# Altium schematic sheet RGBM-02.SchDoc
size Tabloid; SheetNumber: 2; SheetTotal: 7
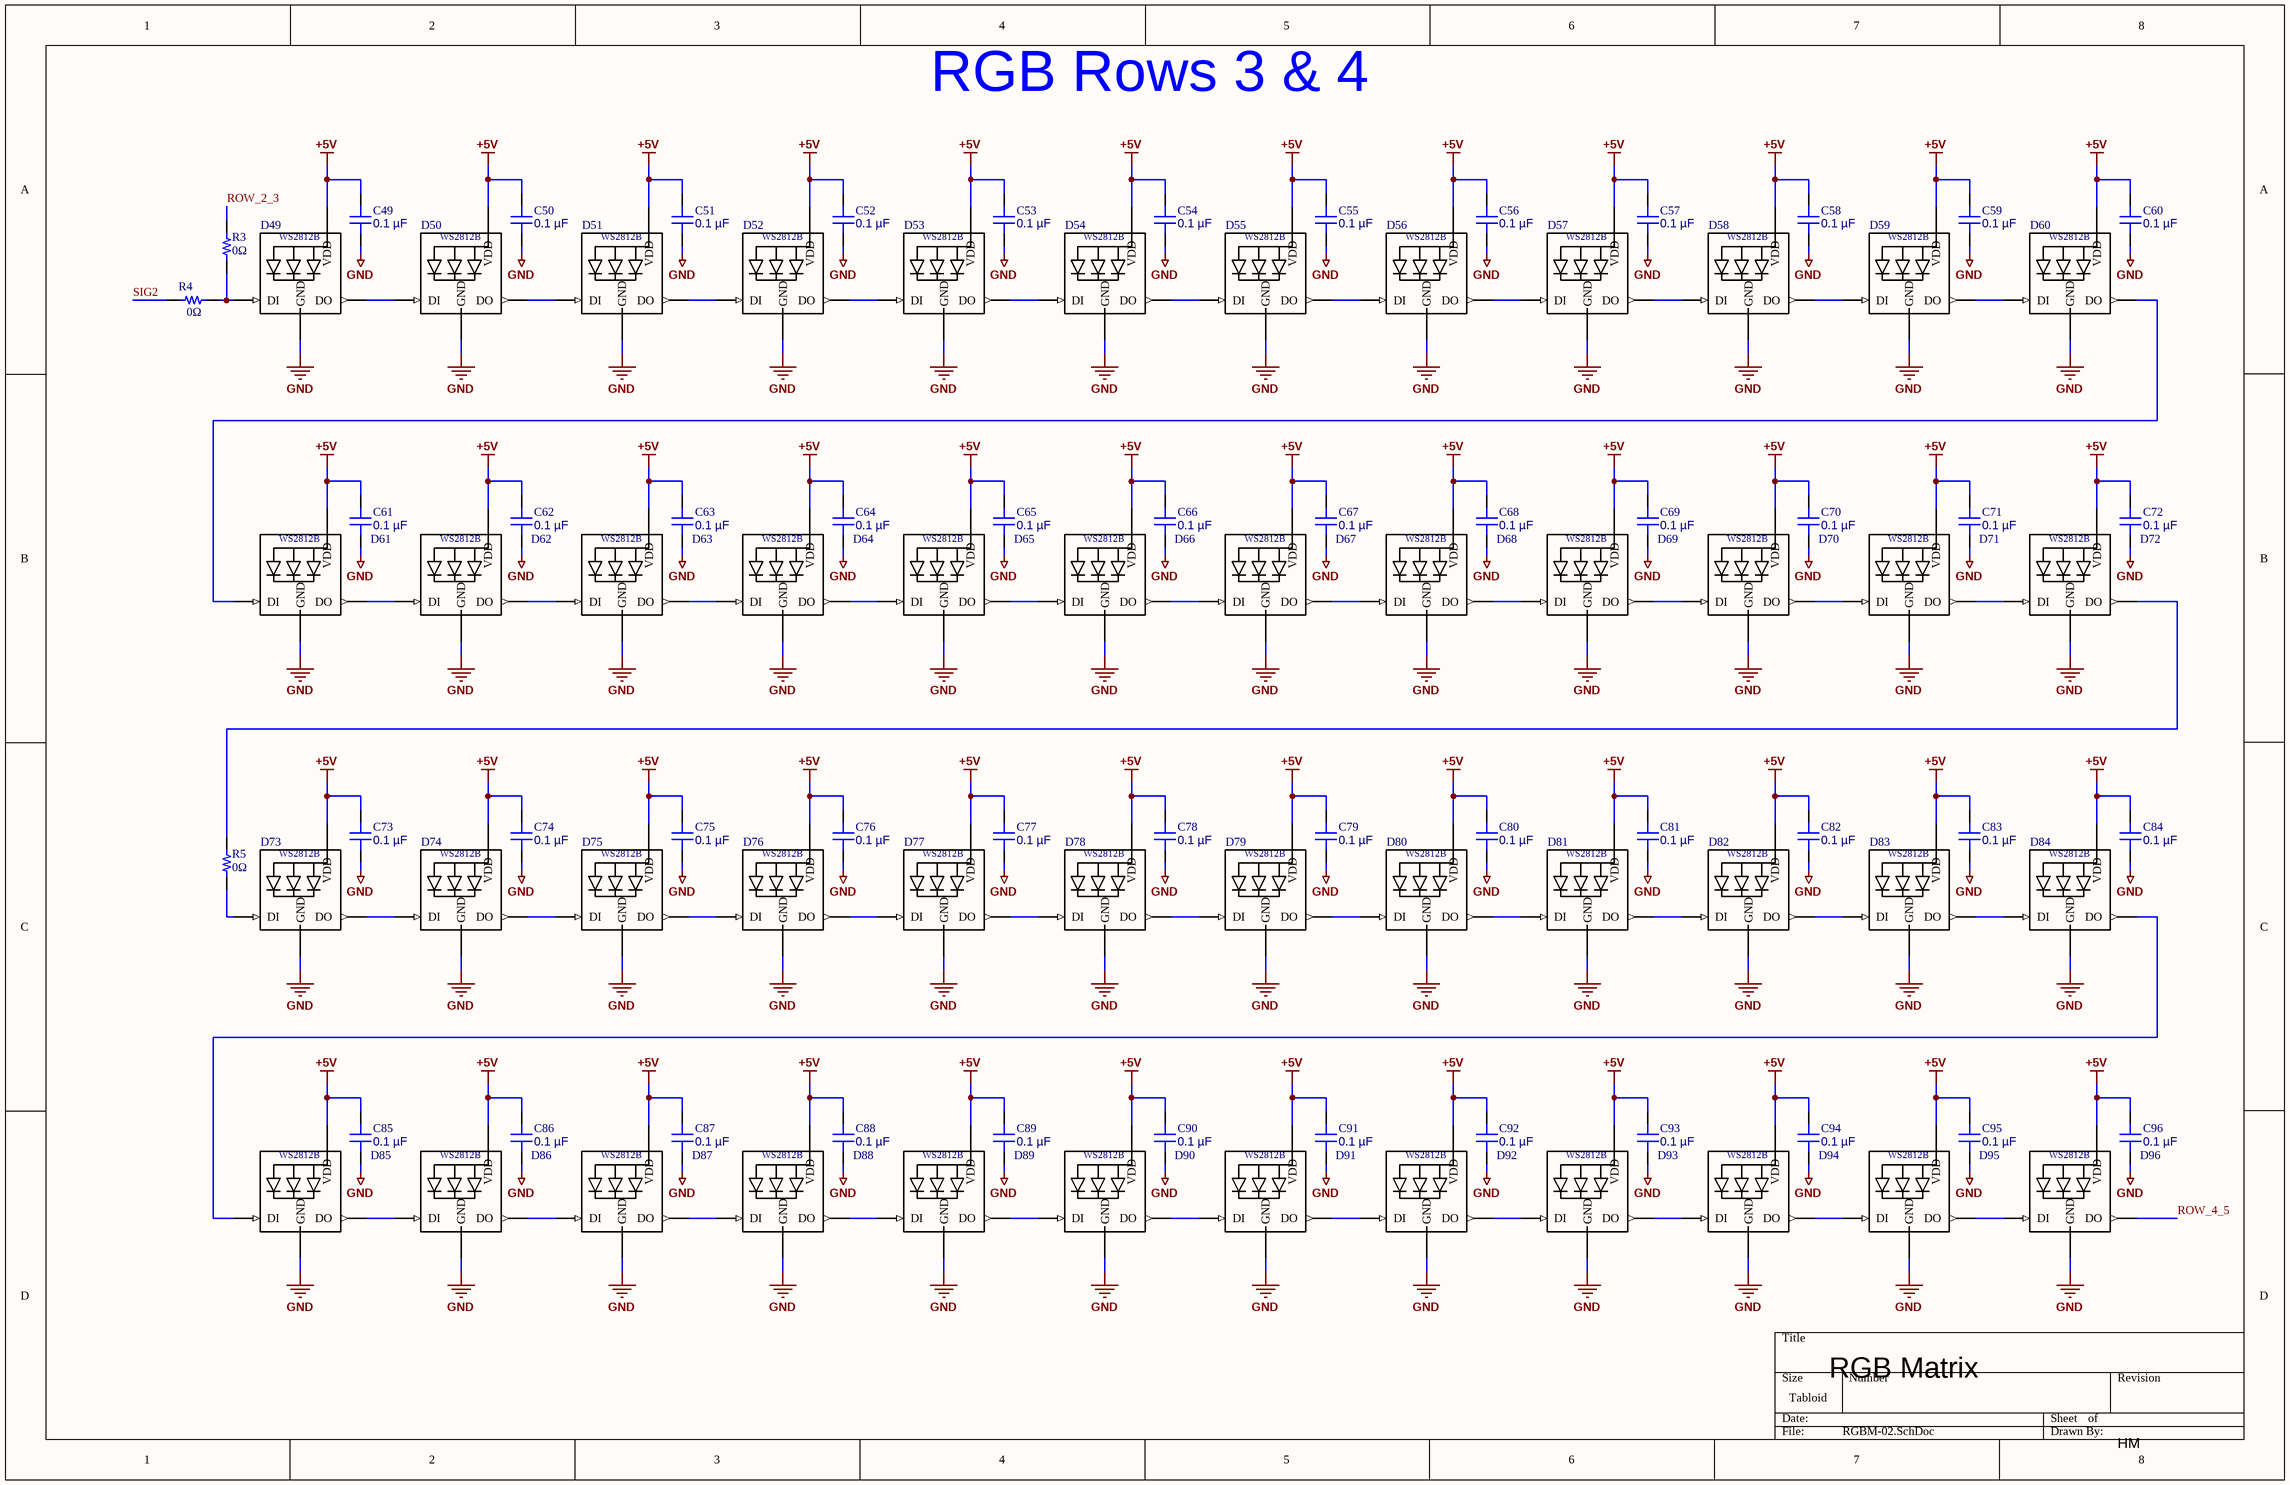
[diagram p0: RGBM-02.SchDoc]

## Parts
C49  0.1 µF  [CAP 0603_1608]
C50  0.1 µF  [CAP 0603_1608]
C51  0.1 µF  [CAP 0603_1608]
C52  0.1 µF  [CAP 0603_1608]
C53  0.1 µF  [CAP 0603_1608]
C54  0.1 µF  [CAP 0603_1608]
C55  0.1 µF  [CAP 0603_1608]
C56  0.1 µF  [CAP 0603_1608]
C57  0.1 µF  [CAP 0603_1608]
C58  0.1 µF  [CAP 0603_1608]
C59  0.1 µF  [CAP 0603_1608]
C60  0.1 µF  [CAP 0603_1608]
C61  0.1 µF  [CAP 0603_1608]
C62  0.1 µF  [CAP 0603_1608]
C63  0.1 µF  [CAP 0603_1608]
C64  0.1 µF  [CAP 0603_1608]
C65  0.1 µF  [CAP 0603_1608]
C66  0.1 µF  [CAP 0603_1608]
C67  0.1 µF  [CAP 0603_1608]
C68  0.1 µF  [CAP 0603_1608]
C69  0.1 µF  [CAP 0603_1608]
C70  0.1 µF  [CAP 0603_1608]
C71  0.1 µF  [CAP 0603_1608]
C72  0.1 µF  [CAP 0603_1608]
C73  0.1 µF  [CAP 0603_1608]
C74  0.1 µF  [CAP 0603_1608]
C75  0.1 µF  [CAP 0603_1608]
C76  0.1 µF  [CAP 0603_1608]
C77  0.1 µF  [CAP 0603_1608]
C78  0.1 µF  [CAP 0603_1608]
C79  0.1 µF  [CAP 0603_1608]
C80  0.1 µF  [CAP 0603_1608]
C81  0.1 µF  [CAP 0603_1608]
C82  0.1 µF  [CAP 0603_1608]
C83  0.1 µF  [CAP 0603_1608]
C84  0.1 µF  [CAP 0603_1608]
C85  0.1 µF  [CAP 0603_1608]
C86  0.1 µF  [CAP 0603_1608]
C87  0.1 µF  [CAP 0603_1608]
C88  0.1 µF  [CAP 0603_1608]
C89  0.1 µF  [CAP 0603_1608]
C90  0.1 µF  [CAP 0603_1608]
C91  0.1 µF  [CAP 0603_1608]
C92  0.1 µF  [CAP 0603_1608]
C93  0.1 µF  [CAP 0603_1608]
C94  0.1 µF  [CAP 0603_1608]
C95  0.1 µF  [CAP 0603_1608]
C96  0.1 µF  [CAP 0603_1608]
D49  WS2812B  [*WS2812B_WS2812B(Primary)]  (value not drawn)
D50  WS2812B  [*WS2812B_WS2812B(Primary)]  (value not drawn)
D51  WS2812B  [*WS2812B_WS2812B(Primary)]  (value not drawn)
D52  WS2812B  [*WS2812B_WS2812B(Primary)]  (value not drawn)
D53  WS2812B  [*WS2812B_WS2812B(Primary)]  (value not drawn)
D54  WS2812B  [*WS2812B_WS2812B(Primary)]  (value not drawn)
D55  WS2812B  [*WS2812B_WS2812B(Primary)]  (value not drawn)
D56  WS2812B  [*WS2812B_WS2812B(Primary)]  (value not drawn)
D57  WS2812B  [*WS2812B_WS2812B(Primary)]  (value not drawn)
D58  WS2812B  [*WS2812B_WS2812B(Primary)]  (value not drawn)
D59  WS2812B  [*WS2812B_WS2812B(Primary)]  (value not drawn)
D60  WS2812B  [*WS2812B_WS2812B(Primary)]  (value not drawn)
D61  WS2812B  [*WS2812B_WS2812B(Primary)]  (value not drawn)
D62  WS2812B  [*WS2812B_WS2812B(Primary)]  (value not drawn)
D63  WS2812B  [*WS2812B_WS2812B(Primary)]  (value not drawn)
D64  WS2812B  [*WS2812B_WS2812B(Primary)]  (value not drawn)
D65  WS2812B  [*WS2812B_WS2812B(Primary)]  (value not drawn)
D66  WS2812B  [*WS2812B_WS2812B(Primary)]  (value not drawn)
D67  WS2812B  [*WS2812B_WS2812B(Primary)]  (value not drawn)
D68  WS2812B  [*WS2812B_WS2812B(Primary)]  (value not drawn)
D69  WS2812B  [*WS2812B_WS2812B(Primary)]  (value not drawn)
D70  WS2812B  [*WS2812B_WS2812B(Primary)]  (value not drawn)
D71  WS2812B  [*WS2812B_WS2812B(Primary)]  (value not drawn)
D72  WS2812B  [*WS2812B_WS2812B(Primary)]  (value not drawn)
D73  WS2812B  [*WS2812B_WS2812B(Primary)]  (value not drawn)
D74  WS2812B  [*WS2812B_WS2812B(Primary)]  (value not drawn)
D75  WS2812B  [*WS2812B_WS2812B(Primary)]  (value not drawn)
D76  WS2812B  [*WS2812B_WS2812B(Primary)]  (value not drawn)
D77  WS2812B  [*WS2812B_WS2812B(Primary)]  (value not drawn)
D78  WS2812B  [*WS2812B_WS2812B(Primary)]  (value not drawn)
D79  WS2812B  [*WS2812B_WS2812B(Primary)]  (value not drawn)
D80  WS2812B  [*WS2812B_WS2812B(Primary)]  (value not drawn)
D81  WS2812B  [*WS2812B_WS2812B(Primary)]  (value not drawn)
D82  WS2812B  [*WS2812B_WS2812B(Primary)]  (value not drawn)
D83  WS2812B  [*WS2812B_WS2812B(Primary)]  (value not drawn)
D84  WS2812B  [*WS2812B_WS2812B(Primary)]  (value not drawn)
D85  WS2812B  [*WS2812B_WS2812B(Primary)]  (value not drawn)
D86  WS2812B  [*WS2812B_WS2812B(Primary)]  (value not drawn)
D87  WS2812B  [*WS2812B_WS2812B(Primary)]  (value not drawn)
D88  WS2812B  [*WS2812B_WS2812B(Primary)]  (value not drawn)
D89  WS2812B  [*WS2812B_WS2812B(Primary)]  (value not drawn)
D90  WS2812B  [*WS2812B_WS2812B(Primary)]  (value not drawn)
D91  WS2812B  [*WS2812B_WS2812B(Primary)]  (value not drawn)
D92  WS2812B  [*WS2812B_WS2812B(Primary)]  (value not drawn)
D93  WS2812B  [*WS2812B_WS2812B(Primary)]  (value not drawn)
D94  WS2812B  [*WS2812B_WS2812B(Primary)]  (value not drawn)
D95  WS2812B  [*WS2812B_WS2812B(Primary)]  (value not drawn)
D96  WS2812B  [*WS2812B_WS2812B(Primary)]  (value not drawn)
R3  0Ω  [RES 0603_1608]
R4  0Ω  [RES 0603_1608]
R5  0Ω  [RES 0603_1608]

## Nets
+5V: C49.2 C50.2 C51.2 C52.2 C53.2 C54.2 C55.2 C56.2 C57.2 C58.2 C59.2 C60.2 C61.2 C62.2 C63.2 C64.2 C65.2 C66.2 C67.2 C68.2 C69.2 C70.2 C71.2 C72.2 C73.2 C74.2 C75.2 C76.2 C77.2 C78.2 C79.2 C80.2 C81.2 C82.2 C83.2 C84.2 C85.2 C86.2 C87.2 C88.2 C89.2 C90.2 C91.2 C92.2 C93.2 C94.2 C95.2 C96.2 D49.1-VDD(VDD) D50.1-VDD(VDD) D51.1-VDD(VDD) D52.1-VDD(VDD) D53.1-VDD(VDD) D54.1-VDD(VDD) D55.1-VDD(VDD) D56.1-VDD(VDD) D57.1-VDD(VDD) D58.1-VDD(VDD) D59.1-VDD(VDD) D60.1-VDD(VDD) D61.1-VDD(VDD) D62.1-VDD(VDD) D63.1-VDD(VDD) D64.1-VDD(VDD) D65.1-VDD(VDD) D66.1-VDD(VDD) D67.1-VDD(VDD) D68.1-VDD(VDD) D69.1-VDD(VDD) D70.1-VDD(VDD) D71.1-VDD(VDD) D72.1-VDD(VDD) D73.1-VDD(VDD) D74.1-VDD(VDD) D75.1-VDD(VDD) D76.1-VDD(VDD) D77.1-VDD(VDD) D78.1-VDD(VDD) D79.1-VDD(VDD) D80.1-VDD(VDD) D81.1-VDD(VDD) D82.1-VDD(VDD) D83.1-VDD(VDD) D84.1-VDD(VDD) D85.1-VDD(VDD) D86.1-VDD(VDD) D87.1-VDD(VDD) D88.1-VDD(VDD) D89.1-VDD(VDD) D90.1-VDD(VDD) D91.1-VDD(VDD) D92.1-VDD(VDD) D93.1-VDD(VDD) D94.1-VDD(VDD) D95.1-VDD(VDD) D96.1-VDD(VDD)
GND: C49.1 C50.1 C51.1 C52.1 C53.1 C54.1 C55.1 C56.1 C57.1 C58.1 C59.1 C60.1 C61.1 C62.1 C63.1 C64.1 C65.1 C66.1 C67.1 C68.1 C69.1 C70.1 C71.1 C72.1 C73.1 C74.1 C75.1 C76.1 C77.1 C78.1 C79.1 C80.1 C81.1 C82.1 C83.1 C84.1 C85.1 C86.1 C87.1 C88.1 C89.1 C90.1 C91.1 C92.1 C93.1 C94.1 C95.1 C96.1 D49.3-GND(GND) D50.3-GND(GND) D51.3-GND(GND) D52.3-GND(GND) D53.3-GND(GND) D54.3-GND(GND) D55.3-GND(GND) D56.3-GND(GND) D57.3-GND(GND) D58.3-GND(GND) D59.3-GND(GND) D60.3-GND(GND) D61.3-GND(GND) D62.3-GND(GND) D63.3-GND(GND) D64.3-GND(GND) D65.3-GND(GND) D66.3-GND(GND) D67.3-GND(GND) D68.3-GND(GND) D69.3-GND(GND) D70.3-GND(GND) D71.3-GND(GND) D72.3-GND(GND) D73.3-GND(GND) D74.3-GND(GND) D75.3-GND(GND) D76.3-GND(GND) D77.3-GND(GND) D78.3-GND(GND) D79.3-GND(GND) D80.3-GND(GND) D81.3-GND(GND) D82.3-GND(GND) D83.3-GND(GND) D84.3-GND(GND) D85.3-GND(GND) D86.3-GND(GND) D87.3-GND(GND) D88.3-GND(GND) D89.3-GND(GND) D90.3-GND(GND) D91.3-GND(GND) D92.3-GND(GND) D93.3-GND(GND) D94.3-GND(GND) D95.3-GND(GND) D96.3-GND(GND)
ROW_2_3: R3.2
ROW_4_5: D96.2-DOUT(DO)
SIG2: R4.1
NetD49_2-DOUT: D49.2-DOUT(DO) D50.4-DIN(DI)
NetD49_4-DIN: D49.4-DIN(DI) R3.1 R4.2
NetD50_2-DOUT: D50.2-DOUT(DO) D51.4-DIN(DI)
NetD51_2-DOUT: D51.2-DOUT(DO) D52.4-DIN(DI)
NetD52_2-DOUT: D52.2-DOUT(DO) D53.4-DIN(DI)
NetD53_2-DOUT: D53.2-DOUT(DO) D54.4-DIN(DI)
NetD54_2-DOUT: D54.2-DOUT(DO) D55.4-DIN(DI)
NetD55_2-DOUT: D55.2-DOUT(DO) D56.4-DIN(DI)
NetD56_2-DOUT: D56.2-DOUT(DO) D57.4-DIN(DI)
NetD57_2-DOUT: D57.2-DOUT(DO) D58.4-DIN(DI)
NetD58_2-DOUT: D58.2-DOUT(DO) D59.4-DIN(DI)
NetD59_2-DOUT: D59.2-DOUT(DO) D60.4-DIN(DI)
NetD60_2-DOUT: D60.2-DOUT(DO) D61.4-DIN(DI)
NetD61_2-DOUT: D61.2-DOUT(DO) D62.4-DIN(DI)
NetD62_2-DOUT: D62.2-DOUT(DO) D63.4-DIN(DI)
NetD63_2-DOUT: D63.2-DOUT(DO) D64.4-DIN(DI)
NetD64_2-DOUT: D64.2-DOUT(DO) D65.4-DIN(DI)
NetD65_2-DOUT: D65.2-DOUT(DO) D66.4-DIN(DI)
NetD66_2-DOUT: D66.2-DOUT(DO) D67.4-DIN(DI)
NetD67_2-DOUT: D67.2-DOUT(DO) D68.4-DIN(DI)
NetD68_2-DOUT: D68.2-DOUT(DO) D69.4-DIN(DI)
NetD69_2-DOUT: D69.2-DOUT(DO) D70.4-DIN(DI)
NetD70_2-DOUT: D70.2-DOUT(DO) D71.4-DIN(DI)
NetD71_2-DOUT: D71.2-DOUT(DO) D72.4-DIN(DI)
NetD72_2-DOUT: D72.2-DOUT(DO) R5.2
NetD73_2-DOUT: D73.2-DOUT(DO) D74.4-DIN(DI)
NetD73_4-DIN: D73.4-DIN(DI) R5.1
NetD74_2-DOUT: D74.2-DOUT(DO) D75.4-DIN(DI)
NetD75_2-DOUT: D75.2-DOUT(DO) D76.4-DIN(DI)
NetD76_2-DOUT: D76.2-DOUT(DO) D77.4-DIN(DI)
NetD77_2-DOUT: D77.2-DOUT(DO) D78.4-DIN(DI)
NetD78_2-DOUT: D78.2-DOUT(DO) D79.4-DIN(DI)
NetD79_2-DOUT: D79.2-DOUT(DO) D80.4-DIN(DI)
NetD80_2-DOUT: D80.2-DOUT(DO) D81.4-DIN(DI)
NetD81_2-DOUT: D81.2-DOUT(DO) D82.4-DIN(DI)
NetD82_2-DOUT: D82.2-DOUT(DO) D83.4-DIN(DI)
NetD83_2-DOUT: D83.2-DOUT(DO) D84.4-DIN(DI)
NetD84_2-DOUT: D84.2-DOUT(DO) D85.4-DIN(DI)
NetD85_2-DOUT: D85.2-DOUT(DO) D86.4-DIN(DI)
NetD86_2-DOUT: D86.2-DOUT(DO) D87.4-DIN(DI)
NetD87_2-DOUT: D87.2-DOUT(DO) D88.4-DIN(DI)
NetD88_2-DOUT: D88.2-DOUT(DO) D89.4-DIN(DI)
NetD89_2-DOUT: D89.2-DOUT(DO) D90.4-DIN(DI)
NetD90_2-DOUT: D90.2-DOUT(DO) D91.4-DIN(DI)
NetD91_2-DOUT: D91.2-DOUT(DO) D92.4-DIN(DI)
NetD92_2-DOUT: D92.2-DOUT(DO) D93.4-DIN(DI)
NetD93_2-DOUT: D93.2-DOUT(DO) D94.4-DIN(DI)
NetD94_2-DOUT: D94.2-DOUT(DO) D95.4-DIN(DI)
NetD95_2-DOUT: D95.2-DOUT(DO) D96.4-DIN(DI)

## Notes on the sheet
- RGB Rows 3 & 4
- RGB Matrix
- HM

## Library data of the parts
C49-C96 = C0603C104K5RAC7411: CAP CER 0.1UF 50V X7R 0603; manufacturer: KEMET; Tolerance: ±10%; Part Number: C0603C104K5RAC7411; Capacitance: 0.1 µF; Applications: Bypass, Decoupling; componentlink1description: Datasheet; componentlink1url: https://api.kemet.com/component-edge/download/datasheet/C0603C104K5RAC7411.pdf; componentlink2description: DigiKey Link; componentlink2url: https://www.digikey.com/en/products/detail/kemet/C0603C104K5RAC7411/3317013; Device Package: 0603 (1608 Metric); lastupdated: 2026-04-06 7:23:52 PM; Lifecycle Status: Active; Minimum Order: 1; Mounting Type: Surface Mount, MLCC; Operating Temperature: -55°C ~ 125°C; Package / Case: 0603 (1608 Metric); packaging: TapeAndReel; partid: 2233; Part Status: Active; price: 0.01; series: SMD Comm X7R; Size / Dimension: 0.063" L x 0.031" W (1.60mm x 0.80mm); Supplier 1: DigiKey; Supplier Part Number 1: 399-C0603C104K5RAC7411CT-ND; Temperature Coefficient: X7R; Thickness (Max): 0.035" (0.90mm); value: 0.1 µF; Voltage - Rated: 50V
D49-D96 = WS2812B: Intelligent control LED integrated light source; MF: Worldsemi; SnapEDA_Link: https://www.snapeda.com/parts/WS2812B/Worldsemi/view-part/?ref=snap; Package: None; MP: WS2812B; Check_prices: https://www.snapeda.com/parts/WS2812B/Worldsemi/view-part/?ref=eda; Value: *
R3-R5 = YJP1608-R001: RES SMD 0 OHM JUMPER 0603; Manufacturer: Susumu; Value: 0 Ohms; Part Number: YJP1608-R001; ComponentLink1Description: Datasheet; ComponentLink1URL: http://www.susumu.co.jp/common/pdf/n_catalog_partition10_en.pdf; ComponentLink2Description: DigiKey Link; ComponentLink2URL: https://www.digikey.com/en/products/detail/susumu/YJP1608-R001/2815047; Composition: Thin Film; Device Package: 0603 (1608 Metric); Height - Seated (Max): 0.016" (0.40mm); LastUpdated: 2024-02-09 8:42:50 PM; Lifecycle Status: Active; Minimum Order: 1; Number of Terminations: 2; Operating Temperature: -40°C ~ 125°C; Package / Case: 0603 (1608 Metric); Packaging: TapeAndReel; PartId: 16802; Part Status: Active; Price: 0.08; Resistance: 0 Ohms; Series: YJP; Size / Dimension: 0.063" L x 0.031" W (1.60mm x 0.80mm); Supplier 1: DigiKey; Supplier Part Number 1: 408-1515-1-ND; Supplier Device Package: 0603; Tolerance: Jumper